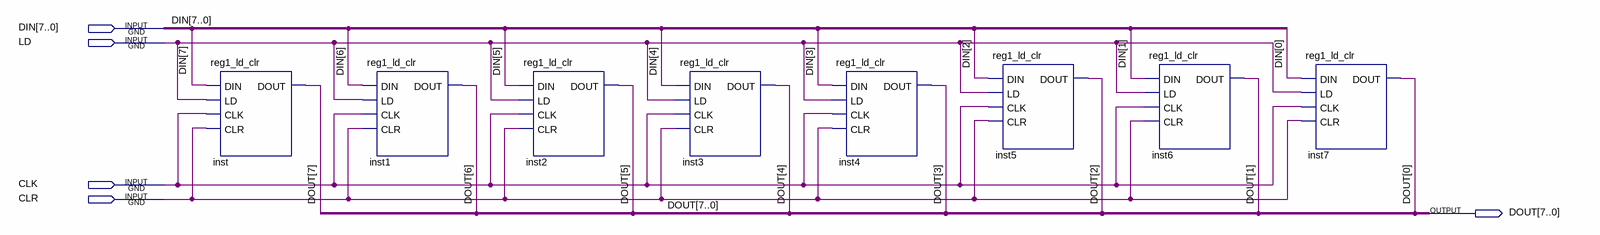
[diagram p0: schematic sheet]
// Quartus schematic reg8_ld_clr.bdf as structural Verilog: 8 symbols, 5 pins
module reg8_ld_clr (
  input  [7:0] DIN,
  input  LD,
  input  CLK,
  input  CLR,
  output [7:0] DOUT
);

  reg1_ld_clr inst (.DIN(DIN[7]), .LD(LD), .CLK(CLK), .CLR(CLR), .DOUT(DOUT[7]));
  reg1_ld_clr inst1 (.DIN(DIN[6]), .LD(LD), .CLK(CLK), .CLR(CLR), .DOUT(DOUT[6]));
  reg1_ld_clr inst2 (.DIN(DIN[5]), .LD(LD), .CLK(CLK), .CLR(CLR), .DOUT(DOUT[5]));
  reg1_ld_clr inst3 (.DIN(DIN[4]), .LD(LD), .CLK(CLK), .CLR(CLR), .DOUT(DOUT[4]));
  reg1_ld_clr inst4 (.DIN(DIN[3]), .LD(LD), .CLK(CLK), .CLR(CLR), .DOUT(DOUT[3]));
  reg1_ld_clr inst5 (.DIN(DIN[2]), .LD(LD), .CLK(CLK), .CLR(CLR), .DOUT(DOUT[2]));
  reg1_ld_clr inst6 (.DIN(DIN[1]), .LD(LD), .CLK(CLK), .CLR(CLR), .DOUT(DOUT[1]));
  reg1_ld_clr inst7 (.DIN(DIN[0]), .LD(LD), .CLK(CLK), .CLR(CLR), .DOUT(DOUT[0]));
endmodule
